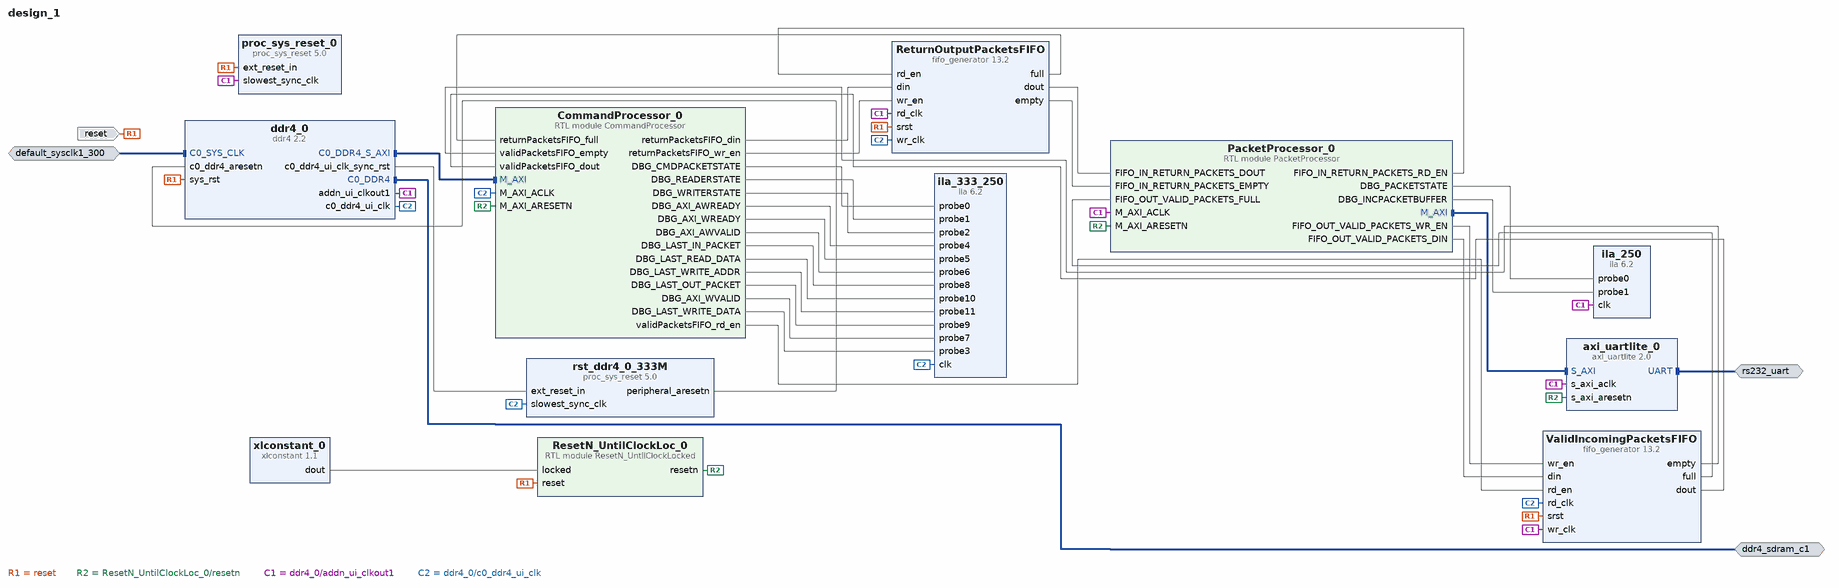
[diagram p0: block diagram of the top level]
# Vivado block design design_1, xcku5p-ffvb676-2-e, Vivado 2018.1
create_bd_design design_1

create_bd_intf_port -mode Master -vlnv xilinx.com:interface:uart_rtl:1.0 rs232_uart
create_bd_intf_port -mode Slave -vlnv xilinx.com:interface:diff_clock_rtl:1.0 default_sysclk1_300
set_property -dict {CONFIG.FREQ_HZ 300000000} [get_bd_intf_ports default_sysclk1_300]
create_bd_intf_port -mode Master -vlnv xilinx.com:interface:ddr4_rtl:1.0 ddr4_sdram_c1
create_bd_port -dir I -type rst reset
set_property -dict {CONFIG.POLARITY ACTIVE_HIGH} [get_bd_ports reset]

create_bd_cell -type ip -vlnv xilinx.com:ip:axi_uartlite:2.0 axi_uartlite_0
set_property -dict [list \
  CONFIG.C_BAUDRATE 921600 \
  CONFIG.C_S_AXI_ACLK_FREQ_HZ 250000000 \
  CONFIG.C_S_AXI_ACLK_FREQ_HZ_d 250 \
  CONFIG.PARITY Odd \
  CONFIG.C_USE_PARITY 1 \
  CONFIG.C_ODD_PARITY 1 \
  CONFIG.USE_BOARD_FLOW true \
  CONFIG.UARTLITE_BOARD_INTERFACE rs232_uart \
] [get_bd_cells axi_uartlite_0]
create_bd_cell -type ip -vlnv xilinx.com:ip:fifo_generator:13.2 ValidIncomingPacketsFIFO
set_property -dict [list \
  CONFIG.Fifo_Implementation Independent_Clocks_Builtin_FIFO \
  CONFIG.Performance_Options First_Word_Fall_Through \
  CONFIG.Input_Data_Width 88 \
  CONFIG.Input_Depth 512 \
  CONFIG.Use_Embedded_Registers true \
  CONFIG.Read_Clock_Frequency 333 \
  CONFIG.Write_Clock_Frequency 250 \
] [get_bd_cells ValidIncomingPacketsFIFO]
create_bd_cell -type ip -vlnv xilinx.com:ip:fifo_generator:13.2 ReturnOutputPacketsFIFO
set_property -dict [list \
  CONFIG.Fifo_Implementation Independent_Clocks_Builtin_FIFO \
  CONFIG.Performance_Options First_Word_Fall_Through \
  CONFIG.Input_Data_Width 88 \
  CONFIG.Input_Depth 512 \
  CONFIG.Read_Clock_Frequency 250 \
  CONFIG.Write_Clock_Frequency 333 \
] [get_bd_cells ReturnOutputPacketsFIFO]
create_bd_cell -type ip -vlnv xilinx.com:ip:ila:6.2 ila_333_250
set_property -dict [list \
  CONFIG.C_PROBE13_TYPE 1 \
  CONFIG.C_PROBE12_TYPE 1 \
  CONFIG.C_PROBE11_TYPE 1 \
  CONFIG.C_PROBE10_TYPE 1 \
  CONFIG.C_PROBE9_TYPE 1 \
  CONFIG.C_PROBE8_TYPE 1 \
  CONFIG.C_PROBE7_TYPE 1 \
  CONFIG.C_PROBE6_TYPE 1 \
  CONFIG.C_PROBE5_TYPE 1 \
  CONFIG.C_PROBE4_TYPE 1 \
  CONFIG.C_PROBE3_TYPE 1 \
  CONFIG.C_PROBE2_TYPE 1 \
  CONFIG.C_PROBE1_TYPE 1 \
  CONFIG.C_PROBE0_TYPE 1 \
  CONFIG.C_PROBE13_WIDTH 1 \
  CONFIG.C_PROBE12_WIDTH 1 \
  CONFIG.C_PROBE11_WIDTH 32 \
  CONFIG.C_PROBE10_WIDTH 32 \
  CONFIG.C_PROBE9_WIDTH 88 \
  CONFIG.C_PROBE8_WIDTH 88 \
  CONFIG.C_PROBE7_WIDTH 1 \
  CONFIG.C_PROBE3_WIDTH 256 \
  CONFIG.C_PROBE2_WIDTH 8 \
  CONFIG.C_PROBE1_WIDTH 8 \
  CONFIG.C_PROBE0_WIDTH 8 \
  CONFIG.C_NUM_OF_PROBES 12 \
  CONFIG.C_ENABLE_ILA_AXI_MON false \
  CONFIG.C_MONITOR_TYPE Native \
] [get_bd_cells ila_333_250]
create_bd_cell -type ip -vlnv xilinx.com:ip:ddr4:2.2 ddr4_0
set_property -dict [list \
  CONFIG.RESET_BOARD_INTERFACE reset \
  CONFIG.C0_CLOCK_BOARD_INTERFACE default_sysclk1_300 \
  CONFIG.C0_DDR4_BOARD_INTERFACE ddr4_sdram_c1 \
  CONFIG.C0.DDR4_AxiAddressWidth 30 \
  CONFIG.ADDN_UI_CLKOUT1_FREQ_HZ 250 \
  CONFIG.C0.BANK_GROUP_WIDTH 1 \
] [get_bd_cells ddr4_0]
create_bd_cell -type module -reference ResetN_UntilClockLocked ResetN_UntilClockLoc_0
create_bd_cell -type ip -vlnv xilinx.com:ip:proc_sys_reset:5.0 rst_ddr4_0_333M
create_bd_cell -type ip -vlnv xilinx.com:ip:xlconstant:1.1 xlconstant_0
create_bd_cell -type ip -vlnv xilinx.com:ip:proc_sys_reset:5.0 proc_sys_reset_0
set_property -dict {CONFIG.RESET_BOARD_INTERFACE reset} [get_bd_cells proc_sys_reset_0]
create_bd_cell -type ip -vlnv xilinx.com:ip:ila:6.2 ila_250
set_property -dict [list \
  CONFIG.C_PROBE1_TYPE 1 \
  CONFIG.C_PROBE0_TYPE 1 \
  CONFIG.C_PROBE1_WIDTH 88 \
  CONFIG.C_PROBE0_WIDTH 8 \
  CONFIG.C_NUM_OF_PROBES 2 \
  CONFIG.C_ENABLE_ILA_AXI_MON false \
  CONFIG.C_MONITOR_TYPE Native \
] [get_bd_cells ila_250]
create_bd_cell -type module -reference PacketProcessor PacketProcessor_0
create_bd_cell -type module -reference CommandProcessor CommandProcessor_0
set_property -dict {CONFIG.C_M_AXI_ADDR_WIDTH 30 CONFIG.C_M_AXI_DATA_WIDTH 256} [get_bd_cells CommandProcessor_0]

# ---- connections ----

connect_bd_intf_net [get_bd_intf_pins PacketProcessor_0/M_AXI] [get_bd_intf_pins axi_uartlite_0/S_AXI]
connect_bd_intf_net [get_bd_intf_pins ddr4_0/C0_DDR4_S_AXI] [get_bd_intf_pins CommandProcessor_0/M_AXI]
connect_bd_intf_net [get_bd_intf_ports rs232_uart] [get_bd_intf_pins axi_uartlite_0/UART]
connect_bd_intf_net -intf_net default_sysclk1_300_1 [get_bd_intf_ports default_sysclk1_300] [get_bd_intf_pins ddr4_0/C0_SYS_CLK]
connect_bd_intf_net [get_bd_intf_ports ddr4_sdram_c1] [get_bd_intf_pins ddr4_0/C0_DDR4]
connect_bd_net [get_bd_ports reset] \
  [get_bd_pins ValidIncomingPacketsFIFO/srst] [get_bd_pins ReturnOutputPacketsFIFO/srst] [get_bd_pins ddr4_0/sys_rst] \
  [get_bd_pins ResetN_UntilClockLoc_0/reset] [get_bd_pins proc_sys_reset_0/ext_reset_in]
connect_bd_net [get_bd_pins ResetN_UntilClockLoc_0/resetn] \
  [get_bd_pins axi_uartlite_0/s_axi_aresetn] [get_bd_pins PacketProcessor_0/M_AXI_ARESETN] \
  [get_bd_pins CommandProcessor_0/M_AXI_ARESETN]
connect_bd_net [get_bd_pins ValidIncomingPacketsFIFO/full] [get_bd_pins PacketProcessor_0/FIFO_OUT_VALID_PACKETS_FULL]
connect_bd_net [get_bd_pins ValidIncomingPacketsFIFO/empty] [get_bd_pins CommandProcessor_0/validPacketsFIFO_empty]
connect_bd_net [get_bd_pins ValidIncomingPacketsFIFO/dout] [get_bd_pins CommandProcessor_0/validPacketsFIFO_dout]
connect_bd_net [get_bd_pins CommandProcessor_0/validPacketsFIFO_rd_en] [get_bd_pins ValidIncomingPacketsFIFO/rd_en]
connect_bd_net [get_bd_pins CommandProcessor_0/returnPacketsFIFO_din] [get_bd_pins ReturnOutputPacketsFIFO/din]
connect_bd_net [get_bd_pins CommandProcessor_0/returnPacketsFIFO_wr_en] [get_bd_pins ReturnOutputPacketsFIFO/wr_en]
connect_bd_net [get_bd_pins ReturnOutputPacketsFIFO/full] [get_bd_pins CommandProcessor_0/returnPacketsFIFO_full]
connect_bd_net [get_bd_pins ReturnOutputPacketsFIFO/dout] [get_bd_pins PacketProcessor_0/FIFO_IN_RETURN_PACKETS_DOUT]
connect_bd_net [get_bd_pins ReturnOutputPacketsFIFO/empty] [get_bd_pins PacketProcessor_0/FIFO_IN_RETURN_PACKETS_EMPTY]
connect_bd_net [get_bd_pins PacketProcessor_0/FIFO_IN_RETURN_PACKETS_RD_EN] [get_bd_pins ReturnOutputPacketsFIFO/rd_en]
connect_bd_net [get_bd_pins PacketProcessor_0/FIFO_OUT_VALID_PACKETS_WR_EN] [get_bd_pins ValidIncomingPacketsFIFO/wr_en]
connect_bd_net [get_bd_pins PacketProcessor_0/FIFO_OUT_VALID_PACKETS_DIN] [get_bd_pins ValidIncomingPacketsFIFO/din]
connect_bd_net -net CommandProcessor_0_DBG_PACKETSTATE [get_bd_pins CommandProcessor_0/DBG_CMDPACKETSTATE] [get_bd_pins ila_333_250/probe0]
connect_bd_net [get_bd_pins CommandProcessor_0/DBG_READERSTATE] [get_bd_pins ila_333_250/probe1]
connect_bd_net [get_bd_pins CommandProcessor_0/DBG_WRITERSTATE] [get_bd_pins ila_333_250/probe2]
connect_bd_net [get_bd_pins CommandProcessor_0/DBG_AXI_AWREADY] [get_bd_pins ila_333_250/probe4]
connect_bd_net [get_bd_pins CommandProcessor_0/DBG_AXI_WREADY] [get_bd_pins ila_333_250/probe5]
connect_bd_net [get_bd_pins CommandProcessor_0/DBG_AXI_AWVALID] [get_bd_pins ila_333_250/probe6]
connect_bd_net [get_bd_pins CommandProcessor_0/DBG_LAST_IN_PACKET] [get_bd_pins ila_333_250/probe8]
connect_bd_net [get_bd_pins CommandProcessor_0/DBG_LAST_READ_DATA] [get_bd_pins ila_333_250/probe10]
connect_bd_net [get_bd_pins CommandProcessor_0/DBG_LAST_WRITE_ADDR] [get_bd_pins ila_333_250/probe11]
connect_bd_net [get_bd_pins ddr4_0/addn_ui_clkout1] \
  [get_bd_pins axi_uartlite_0/s_axi_aclk] [get_bd_pins ValidIncomingPacketsFIFO/wr_clk] \
  [get_bd_pins ReturnOutputPacketsFIFO/rd_clk] [get_bd_pins ila_250/clk] [get_bd_pins proc_sys_reset_0/slowest_sync_clk] \
  [get_bd_pins PacketProcessor_0/M_AXI_ACLK]
connect_bd_net [get_bd_pins ddr4_0/c0_ddr4_ui_clk] \
  [get_bd_pins rst_ddr4_0_333M/slowest_sync_clk] [get_bd_pins ValidIncomingPacketsFIFO/rd_clk] \
  [get_bd_pins ReturnOutputPacketsFIFO/wr_clk] [get_bd_pins ila_333_250/clk] [get_bd_pins CommandProcessor_0/M_AXI_ACLK]
connect_bd_net [get_bd_pins ddr4_0/c0_ddr4_ui_clk_sync_rst] [get_bd_pins rst_ddr4_0_333M/ext_reset_in]
connect_bd_net [get_bd_pins rst_ddr4_0_333M/peripheral_aresetn] [get_bd_pins ddr4_0/c0_ddr4_aresetn]
connect_bd_net [get_bd_pins xlconstant_0/dout] [get_bd_pins ResetN_UntilClockLoc_0/locked]
connect_bd_net [get_bd_pins PacketProcessor_0/DBG_PACKETSTATE] [get_bd_pins ila_250/probe0]
connect_bd_net [get_bd_pins PacketProcessor_0/DBG_INCPACKETBUFFER] [get_bd_pins ila_250/probe1]
connect_bd_net [get_bd_pins CommandProcessor_0/DBG_LAST_OUT_PACKET] [get_bd_pins ila_333_250/probe9]
connect_bd_net [get_bd_pins CommandProcessor_0/DBG_AXI_WVALID] [get_bd_pins ila_333_250/probe7]
connect_bd_net [get_bd_pins CommandProcessor_0/DBG_LAST_WRITE_DATA] [get_bd_pins ila_333_250/probe3]

# ---- address map ----
assign_bd_address -offset 0x00000000 -range 1G -target_address_space [get_bd_addr_spaces CommandProcessor_0/M_AXI] [get_bd_addr_segs ddr4_0/C0_DDR4_MEMORY_MAP/C0_DDR4_ADDRESS_BLOCK]
assign_bd_address -offset 0x00000000 -range 4K -target_address_space [get_bd_addr_spaces PacketProcessor_0/M_AXI] [get_bd_addr_segs axi_uartlite_0/S_AXI/Reg]

validate_bd_design
save_bd_design
